# Altium project UmTRXv21.PRJPCB (part 2 of 2)

## Sheet LMS.SchDoc
size A3; Revision: 1; SheetNumber: 3
Used 2 times, as channels LMS-a, LMS-b. Parts and nets are listed once, with the designators drawn on the sheet.
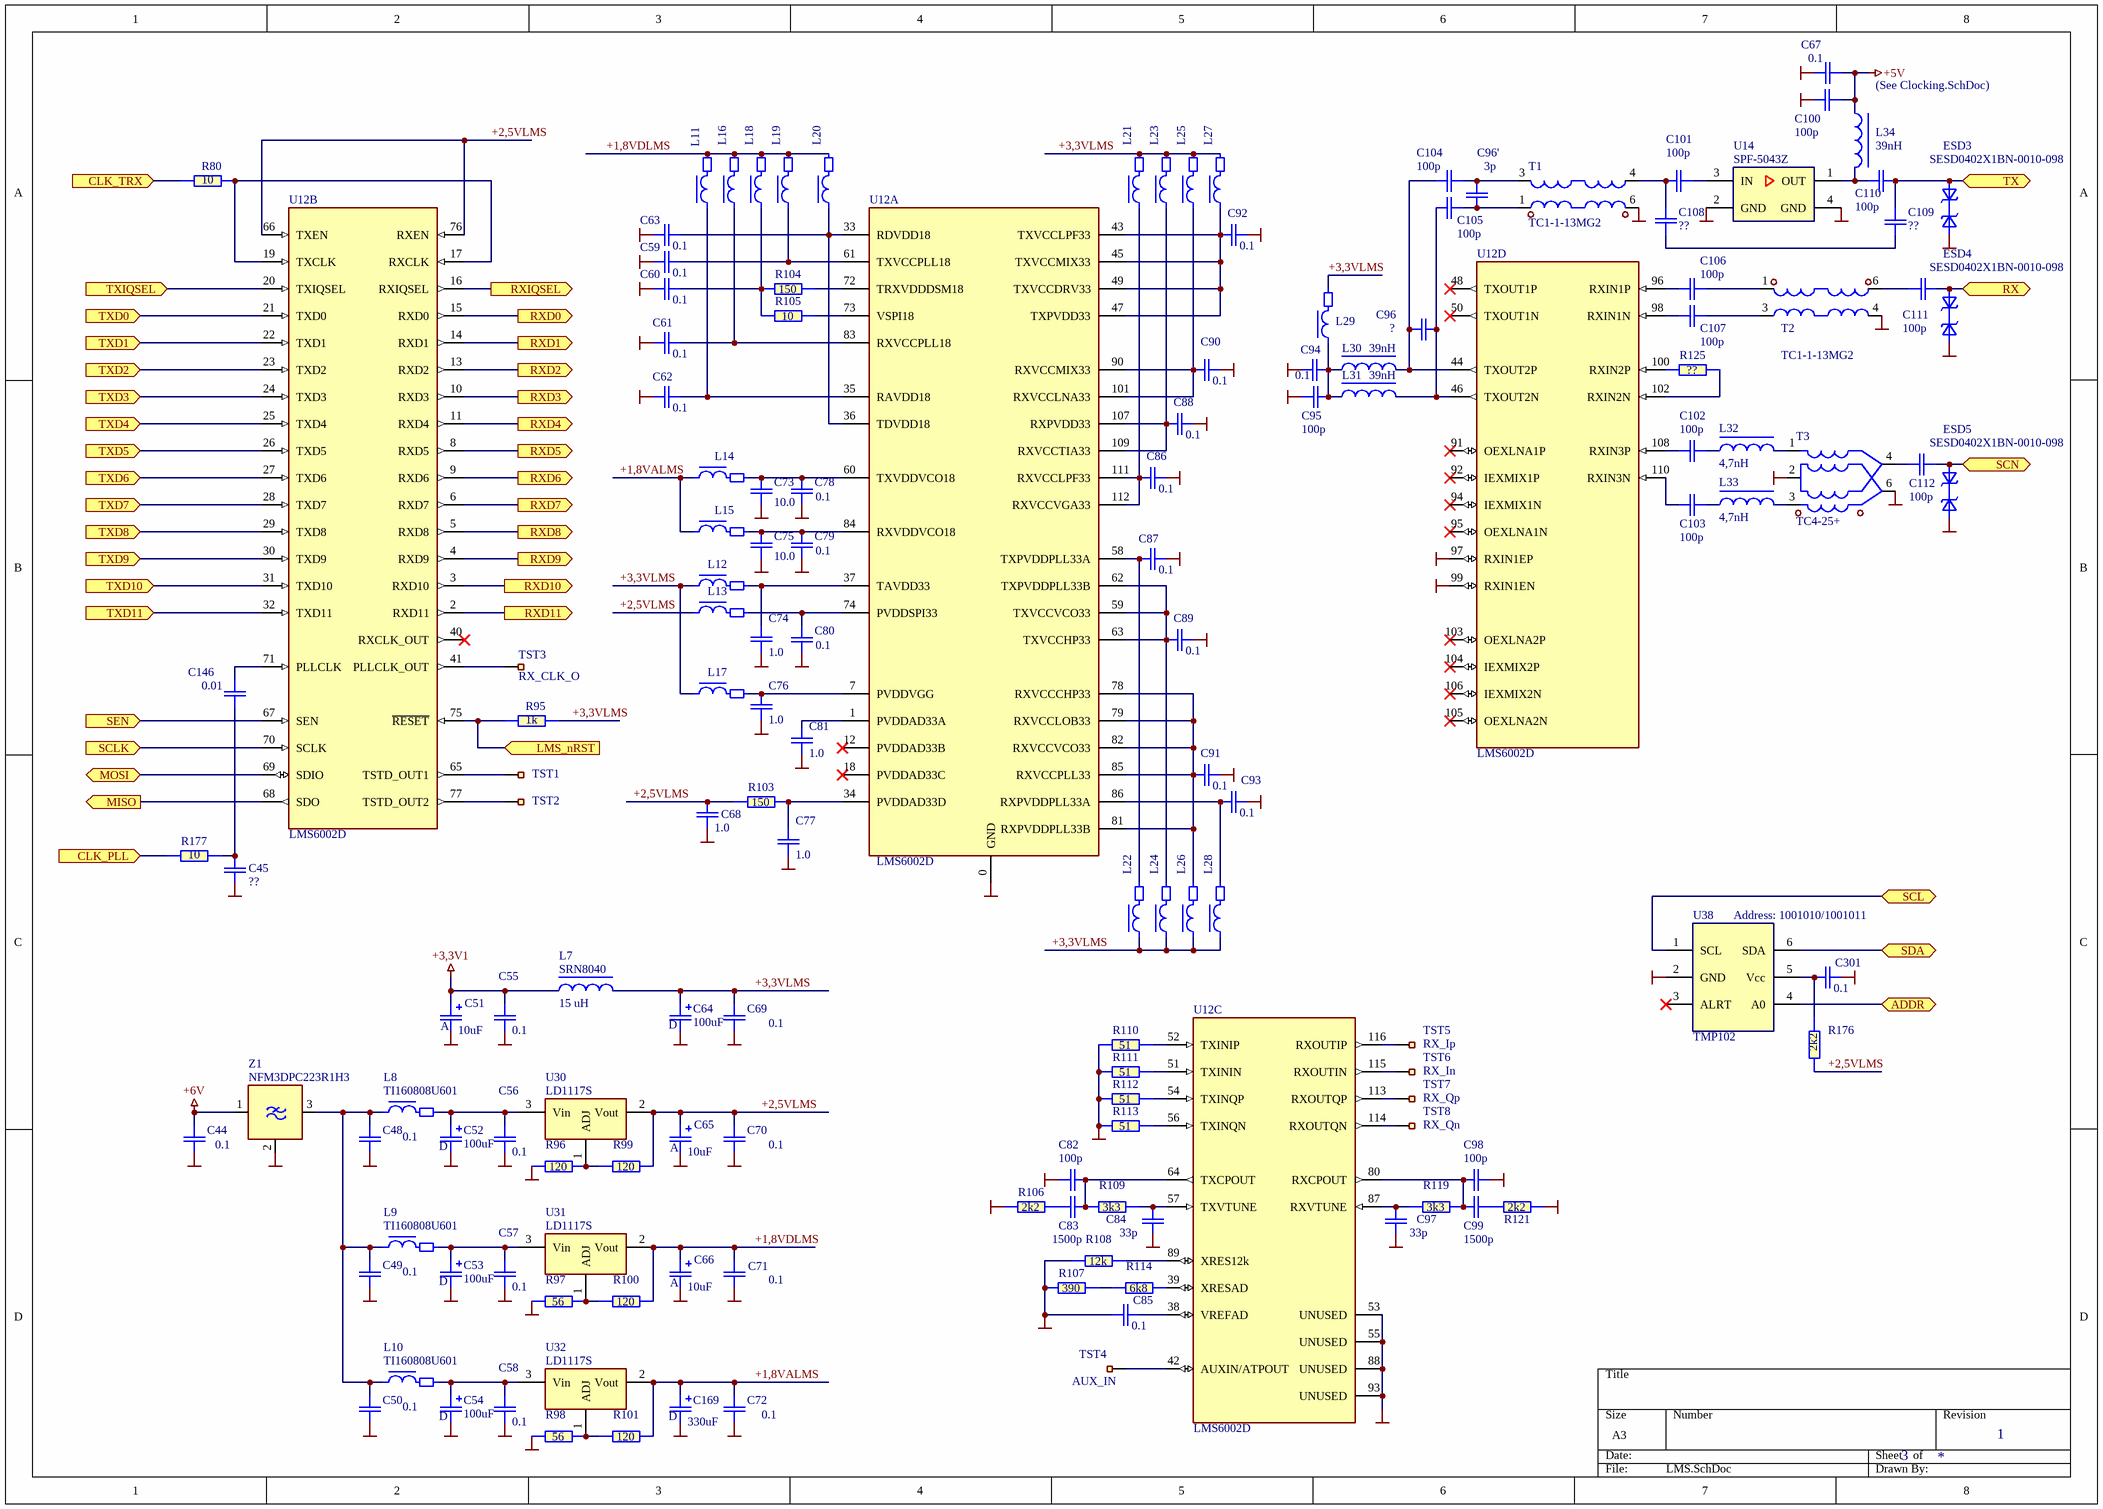
[diagram p4: LMS.SchDoc]

### Parts
C44  0.1  [C0402-Phillips]
C45  ??  [C0603-PHILLIPS]
C48  0.1  [C0402-Phillips]
C49  0.1  [C0402-Phillips]
C50  0.1  [C0402-Phillips]
C51  10uF  [CA3216]
C52  100uF  [cd7343]
C53  100uF  [cd7343]
C54  100uF  [cd7343]
C55  0.1  [C0402-Phillips]
C56  0.1  [C0402-Phillips]
C57  0.1  [C0402-Phillips]
C58  0.1  [C0402-Phillips]
C59  0.1  [C0402-Phillips]
C60  0.1  [C0402-Phillips]
C61  0.1  [C0402-Phillips]
C62  0.1  [C0402-Phillips]
C63  0.1  [C0402-Phillips]
C64  100uF  [cd7343]
C65  10uF  [CA3216]
C66  10uF  [CA3216]
C67  0.1  [C0402-Phillips]
C68  1.0  [C0603-PHILLIPS]
C69  0.1  [C0402-Phillips]
C70  0.1  [C0402-Phillips]
C71  0.1  [C0402-Phillips]
C72  0.1  [C0402-Phillips]
C73  10.0  [C0603-Phillips]
C74  1.0  [C0603-PHILLIPS]
C75  10.0  [C0603-Phillips]
C76  1.0  [C0603-PHILLIPS]
C77  1.0  [C0603-PHILLIPS]
C78  0.1  [C0402-Phillips]
C79  0.1  [C0402-cirq]
C80  0.1  [C0402-cirq]
C81  1.0  [C0603-PHILLIPS]
C82  100p  [C0603-PHILLIPS]
C83  1500p  [C0603-PHILLIPS]
C84  33p  [C0603-PHILLIPS]
C85  0.1  [C0402-Phillips]
C86  0.1  [C0402-Phillips]
C87  0.1  [C0402-Phillips]
C88  0.1  [C0402-cirq]
C89  0.1  [C0402-cirq]
C90  0.1  [C0402-Phillips]
C91  0.1  [C0402-Phillips]
C92  0.1  [C0402-cirq]
C93  0.1  [C0402-Phillips]
C94  0.1  [C0402-Phillips]
C95  100p  [C0603-PHILLIPS]
C96  ?  [C0603-PHILLIPS]
C96'  3p  [C0603-PHILLIPS]
C97  33p  [C0603-PHILLIPS]
C98  100p  [C0603-PHILLIPS]
C99  1500p  [C0603-PHILLIPS]
C100  100p  [C0603-PHILLIPS]
C101  100p  [C0603-PHILLIPS]
C102  100p  [C0603-PHILLIPS]
C103  100p  [C0603-PHILLIPS]
C104  100p  [C0603-PHILLIPS]
C105  100p  [C0603-PHILLIPS]
C106  100p  [C0603-PHILLIPS]
C107  100p  [C0603-PHILLIPS]
C108  ??  [C0603-PHILLIPS]
C109  ??  [C0603-PHILLIPS]
C110  100p  [C0603-PHILLIPS]
C111  100p  [C0603-PHILLIPS]
C112  100p  [C0603-PHILLIPS]
C146  0.01  [C0402-Phillips]
C169  330uF  [cd7343]
C301  0.1  [C0402-Phillips]
ESD3  SESD0402X1BN-0010-098  [R0402-Phillips]
ESD4  SESD0402X1BN-0010-098  [R0402-Phillips]
ESD5  SESD0402X1BN-0010-098  [R0402-Phillips]
L7  15 uH  [SRN8040]
L8  TI160808U601  [Ti160808-Phillips]
L9  TI160808U601  [Ti160808-Phillips]
L10  TI160808U601  [Ti160808-Phillips]
L11  TI160808U601  [Ti160808-Phillips]  (value not drawn)
L12  TI160808U601  [Ti160808-Phillips]  (value not drawn)
L13  TI160808U601  [Ti160808-Phillips]  (value not drawn)
L14  TI160808U601  [Ti160808-Phillips]  (value not drawn)
L15  TI160808U601  [Ti160808-Phillips]  (value not drawn)
L16  TI160808U601  [Ti160808-Phillips]  (value not drawn)
L17  TI160808U601  [Ti160808-Phillips]  (value not drawn)
L18  TI160808U601  [Ti160808-Phillips]  (value not drawn)
L19  TI160808U601  [Ti160808-Phillips]  (value not drawn)
L20  TI160808U601  [Ti160808-Phillips]  (value not drawn)
L21  TI160808U601  [Ti160808-Phillips]  (value not drawn)
L22  TI160808U601  [Ti160808-Phillips]  (value not drawn)
L23  TI160808U601  [Ti160808-Phillips]  (value not drawn)
L24  TI160808U601  [Ti160808-Phillips]  (value not drawn)
L25  TI160808U601  [Ti160808-Phillips]  (value not drawn)
L26  TI160808U601  [Ti160808-Phillips]  (value not drawn)
L27  TI160808U601  [Ti160808-Phillips]  (value not drawn)
L28  TI160808U601  [Ti160808-Phillips]  (value not drawn)
L29  TI160808U601  [Ti160808-Phillips]  (value not drawn)
L30  39nH  [TF160808-Phillips]
L31  39nH  [TF160808-Phillips]
L32  4,7nH  [TF160808-Phillips]
L33  4,7nH  [TF160808-Phillips]
L34  39nH  [TF160808-Phillips]
R80  10  [R0603-PHILLIPS]
R95  1k  [R0603-PHILLIPS]
R96  120  [R0603-PHILLIPS]
R97  56  [R0603-PHILLIPS]
R98  56  [R0603-PHILLIPS]
R99  120  [R0603-PHILLIPS]
R100  120  [R0603-PHILLIPS]
R101  120  [R0603-PHILLIPS]
R103  150  [R0603-PHILLIPS]
R104  150  [R0603-PHILLIPS]
R105  10  [R0603-PHILLIPS]
R106  2k2  [R0603-PHILLIPS]
R107  390  [R0603-PHILLIPS]
R108  12k  [R0603-PHILLIPS]
R109  3k3  [R0603-PHILLIPS]
R110  51  [R0603-PHILLIPS]
R111  51  [R0603-PHILLIPS]
R112  51  [R0603-PHILLIPS]
R113  51  [R0603-PHILLIPS]
R114  6k8  [R0603-PHILLIPS]
R119  3k3  [R0603-PHILLIPS]
R121  2k2  [R0603-PHILLIPS]
R125  ??  [R0603-PHILLIPS]
R176  2k2  [R0603-PHILLIPS]
R177  10  [R0603-PHILLIPS]
T1  TC1-1-13MG2  [AT224-1]
T2  TC1-1-13MG2  [AT224-1]
T3  TC4-25+  [AT224-1]
TST1  (no value)  [kp40x40]
TST2  (no value)  [kp40x40]
TST3  RX_CLK_O  [kp40x40]
TST4  AUX_IN  [kp40x40]
TST5  RX_Ip  [kp40x40]
TST6  RX_In  [kp40x40]
TST7  RX_Qp  [kp40x40]
TST8  RX_Qn  [kp40x40]
U12  LMS6002D  [DQFN120(9x9/0.5mm)]  (parts A,B,C,D of 4)
U14  SPF-5043Z  [SOT-343[2X1.25]]
U30  LD1117S  [SOT-223-1]
U31  LD1117S  [SOT-223-1]
U32  LD1117S  [SOT-223-1]
U38  TMP102  Address: 1001010/1001011  [PDSO-G6]
Z1  NFM3DPC223R1H3  [NFM3DP]

### Ports
ADDR, CLK_PLL (in), CLK_TRX (in), LMS_nRST (in), MISO (out), MOSI (bidir), RX, RXD0 (out), RXD1 (out), RXD2 (out), RXD3 (out), RXD4 (out), RXD5 (out), RXD6 (out), RXD7 (out), RXD8 (out), RXD9 (out), RXD10 (out), RXD11 (out), RXIQSEL (out), SCL, SCLK (in), SCN, SDA, SEN (in), TX, TXD0 (in), TXD1 (in), TXD2 (in), TXD3 (in), TXD4 (in), TXD5 (in), TXD6 (in), TXD7 (in), TXD8 (in), TXD9 (in), TXD10 (in), TXD11 (in), TXIQSEL (in)

### Nets
+3,3V1: C51.1(+) C55.1 L7.1
+5V: C67.2 C100.2 L34.1
+6V: C44.1 Z1.1
GND: C44.2 C45.1 C48.2 C49.2 C50.2 C51.2(-) C52.2(-) C53.2(-) C54.2(-) C55.2 C56.2 C57.2 C58.2 C59.1 C60.1 C61.1 C62.1 C63.1 C64.2(-) C65.2(-) C66.2(-) C67.1 C68.2 C69.2 C70.2 C71.2 C72.2 C73.2 C74.2 C75.2 C76.2 C77.2 C78.2 C79.2 C80.2 C81.2 C82.2 C84.1 C85.1 C86.2 C87.2 C88.2 C89.2 C90.2 C91.2 C92.2 C93.2 C94.1 C95.2 C97.1 C98.2 C100.1 C169.2(-) C301.2 ESD3.1(A1) ESD4.1(A1) ESD5.1(A1) R96.1 R97.1 R98.1 R106.1 R107.1 R108.1 R110.1 R111.1 R112.1 R113.1 R121.2 T1.6(Pri_Dot) T2.4(Pri) T3.2(Sec_CT) T3.6(Pri_Dot) U12.0(GND) U12.53(UNUSED) U12.55(UNUSED) U12.88(UNUSED) U12.93(UNUSED) U12.97(RXIN1EP) U12.99(RXIN1EN) U14.2(GND) U14.4(GND) U38.2(GND) Z1.2
+1,8VALMS: C72.1 C169.1(+) L14.1 L15.1 R101.2 U32.2(Vout)
+1,8VDLMS: C66.1(+) C71.1 L11.2 L16.2 L18.2 L19.2 L20.2 R100.2 U31.2(Vout)
+2,5VLMS: C65.1(+) C68.1 C70.1 L13.1 R99.2 R103.1 R176.1 U12.66(TXEN) U12.76(RXEN) U30.2(Vout)
+3,3VLMS: C64.1(+) C69.1 L7.2 L12.1 L17.1 L21.2 L22.1 L23.2 L24.1 L25.2 L26.1 L27.2 L28.1 L29.2 R95.2
ADDR: U38.4(A0) ; port ADDR
CLK_PLL: R177.1 ; port CLK_PLL
CLK_TRX: R80.1 ; port CLK_TRX
LMS_nRST: R95.1 U12.75(~{RESET}) ; port LMS_nRST
MISO: U12.68(SDO) ; port MISO
MOSI: U12.69(SDIO) ; port MOSI
RX: C111.1 ESD4.2(A2) ; port RX
RXD0: U12.15(RXD0) ; port RXD0
RXD1: U12.14(RXD1) ; port RXD1
RXD2: U12.13(RXD2) ; port RXD2
RXD3: U12.10(RXD3) ; port RXD3
RXD4: U12.11(RXD4) ; port RXD4
RXD5: U12.8(RXD5) ; port RXD5
RXD6: U12.9(RXD6) ; port RXD6
RXD7: U12.6(RXD7) ; port RXD7
RXD8: U12.5(RXD8) ; port RXD8
RXD9: U12.4(RXD9) ; port RXD9
RXD10: U12.3(RXD10) ; port RXD10
RXD11: U12.2(RXD11) ; port RXD11
RXIQSEL: U12.16(RXIQSEL) ; port RXIQSEL
SCL: U38.1(SCL) ; port SCL
SCLK: U12.70(SCLK) ; port SCLK
SCN: C112.2 ESD5.2(A2) ; port SCN
SDA: U38.6(SDA) ; port SDA
SEN: U12.67(SEN) ; port SEN
TX: C109.2 C110.2 ESD3.2(A2) ; port TX
TXD0: U12.21(TXD0) ; port TXD0
TXD1: U12.22(TXD1) ; port TXD1
TXD2: U12.23(TXD2) ; port TXD2
TXD3: U12.24(TXD3) ; port TXD3
TXD4: U12.25(TXD4) ; port TXD4
TXD5: U12.26(TXD5) ; port TXD5
TXD6: U12.27(TXD6) ; port TXD6
TXD7: U12.28(TXD7) ; port TXD7
TXD8: U12.29(TXD8) ; port TXD8
TXD9: U12.30(TXD9) ; port TXD9
TXD10: U12.31(TXD10) ; port TXD10
TXD11: U12.32(TXD11) ; port TXD11
TXIQSEL: U12.20(TXIQSEL) ; port TXIQSEL
NetC45_2: C45.2 C146.1 R177.2
NetC48_1: C48.1 C49.1 C50.1 L8.1 L9.1 L10.1 Z1.3
NetC52_1: C52.1(+) C56.1 L8.2 U30.3(Vin)
NetC53_1: C53.1(+) C57.1 L9.2 U31.3(Vin)
NetC54_1: C54.1(+) C58.1 L10.2 U32.3(Vin)
NetC59_2: C59.2 L19.1 U12.61(TXVCCPLL18)
NetC60_2: C60.2 L18.1 R104.1 R105.1
NetC61_2: C61.2 L16.1 U12.83(RXVCCPLL18)
NetC62_2: C62.2 L11.1 U12.35(RAVDD18)
NetC63_2: C63.2 L20.1 U12.33(RDVDD18) U12.36(TDVDD18)
NetC73_1: C73.1 C78.1 L14.2 U12.60(TXVDDVCO18)
NetC74_1: C74.1 L12.2 U12.37(TAVDD33)
NetC75_1: C75.1 C79.1 L15.2 U12.84(RXVDDVCO18)
NetC76_1: C76.1 L17.2 U12.7(PVDDVGG)
NetC77_1: C77.1 R103.2 U12.34(PVDDAD33D)
NetC80_1: C80.1 L13.2 U12.74(PVDDSPI33)
NetC81_1: C81.1 U12.1(PVDDAD33A)
NetC82_1: C82.1 C83.1 R109.1 U12.64(TXCPOUT)
NetC83_2: C83.2 R106.2
NetC84_2: C84.2 R109.2 U12.57(TXVTUNE)
NetC85_2: C85.2 U12.38(VREFAD)
NetC86_1: C86.1 L21.1 U12.111(RXVCCLPF33) U12.112(RXVCCVGA33)
NetC87_1: C87.1 L22.2 U12.58(TXPVDDPLL33A)
NetC88_1: C88.1 L23.1 U12.107(RXPVDD33) U12.109(RXVCCTIA33)
NetC89_1: C89.1 L24.2 U12.59(TXVCCVCO33) U12.62(TXPVDDPLL33B) U12.63(TXVCCHP33)
NetC90_1: C90.1 L25.1 U12.90(RXVCCMIX33) U12.101(RXVCCLNA33)
NetC91_1: C91.1 L26.2 U12.78(RXVCCCHP33) U12.79(RXVCCLOB33) U12.81(RXPVDDPLL33B) U12.82(RXVCCVCO33) U12.85(RXVCCPLL33)
NetC92_1: C92.1 L27.1 U12.43(TXVCCLPF33) U12.45(TXVCCMIX33) U12.47(TXPVDD33) U12.49(TXVCCDRV33)
NetC93_1: C93.1 L28.2 U12.86(RXPVDDPLL33A)
NetC94_2: C94.2 C95.1 L29.1 L30.1 L31.1
NetC96'_1: C96'.1 C105.2 T1.1(Sec)
NetC96'_2: C96'.2 C104.2 T1.3(Sec_Dot)
NetC96_1: C96.1 C105.1 L31.2 U12.46(TXOUT2N)
NetC96_2: C96.2 C104.1 L30.2 U12.44(TXOUT2P)
NetC97_2: C97.2 R119.1 U12.87(RXVTUNE)
NetC98_1: C98.1 C99.1 R119.2 U12.80(RXCPOUT)
NetC99_2: C99.2 R121.1
NetC101_1: C101.1 C108.1 T1.4(Pri)
NetC101_2: C101.2 U14.3(IN)
NetC102_1: C102.1 U12.108(RXIN3P)
NetC102_2: C102.2 L32.1
NetC103_1: C103.1 U12.110(RXIN3N)
NetC103_2: C103.2 L33.1
NetC106_1: C106.1 U12.96(RXIN1P)
NetC106_2: C106.2 T2.1(Sec)
NetC107_1: C107.1 U12.98(RXIN1N)
NetC107_2: C107.2 T2.3(Sec_Dot)
NetC108_2: C108.2 C109.1
NetC110_1: C110.1 L34.2 U14.1(OUT)
NetC111_2: C111.2 T2.6(Pri_Dot)
NetC112_1: C112.1 T3.4(Pri)
NetC146_2: C146.2 U12.71(PLLCLK)
NetC301_1: C301.1 R176.2 U38.5(Vcc)
NetL32_2: L32.2 T3.1(Sec)
NetL33_2: L33.2 T3.3(Sec_Dot)
NetR80_2: R80.2 U12.17(RXCLK) U12.19(TXCLK)
NetR96_2: R96.2 R99.1 U30.1(ADJ)
NetR97_2: R97.2 R100.1 U31.1(ADJ)
NetR98_2: R98.2 R101.1 U32.1(ADJ)
NetR104_2: R104.2 U12.72(TRXVDDDSM18)
NetR105_2: R105.2 U12.73(VSPI18)
NetR107_2: R107.2 R114.1
NetR108_2: R108.2 U12.89(XRES12k)
NetR110_2: R110.2 U12.52(TXINIP)
NetR111_2: R111.2 U12.51(TXININ)
NetR112_2: R112.2 U12.54(TXINQP)
NetR113_2: R113.2 U12.56(TXINQN)
NetR114_2: R114.2 U12.39(XRESAD)
NetR125_1: R125.1 U12.100(RXIN2P)
NetR125_2: R125.2 U12.102(RXIN2N)
NetTST1_1: TST1.1 U12.65(TSTD_OUT1)
NetTST2_1: TST2.1 U12.77(TSTD_OUT2)
NetTST3_1: TST3.1 U12.41(PLLCLK_OUT)
NetTST4_1: TST4.1 U12.42(AUXIN/ATPOUT)
NetTST5_1: TST5.1 U12.116(RXOUTIP)
NetTST6_1: TST6.1 U12.115(RXOUTIN)
NetTST7_1: TST7.1 U12.113(RXOUTQP)
NetTST8_1: TST8.1 U12.114(RXOUTQN)

Not connected (* = marked no-connect by the designer): U12 12(PVDDAD33B)* 18(PVDDAD33C)* 40(RXCLK_OUT)* 48(TXOUT1P)* 50(TXOUT1N)* 91(OEXLNA1P)* 92(IEXMIX1P)* 94(IEXMIX1N)* 95(OEXLNA1N)* 103(OEXLNA2P)* 104(IEXMIX2P)* 105(OEXLNA2N)* 106(IEXMIX2N)*; U38 3(ALRT)*

### Channels
LMS-a: designators end in -1; ports ADDR=SDA CLK_PLL=CLK_PLL1 CLK_TRX=CLK_TRX1 LMS_nRST=LMS1_nRST MISO=MISO1 MOSI=MOSI1 RX=RX RXD0=RX1D0 RXD1=RX1D1 RXD2=RX1D2 RXD3=RX1D3 RXD4=RX1D4 RXD5=RX1D5 RXD6=RX1D6 RXD7=RX1D7 RXD8=RX1D8 RXD9=RX1D9 RXD10=RX1D10 RXD11=RX1D11 RXIQSEL=RX1IQSEL SCL=SCL SCLK=SCLK1 SCN=SCN SDA=SDA SEN=SEN1 TX=TX TXD0=TX1D0 TXD1=TX1D1 TXD2=TX1D2 TXD3=TX1D3 TXD4=TX1D4 TXD5=TX1D5 TXD6=TX1D6 TXD7=TX1D7 TXD8=TX1D8 TXD9=TX1D9 TXD10=TX1D10 TXD11=TX1D11 TXIQSEL=TX1IQSEL
LMS-b: designators end in -2; ports ADDR=SCL CLK_PLL=CLK_PLL2 CLK_TRX=CLK_TRX2 LMS_nRST=LMS2_nRST MISO=MISO2 MOSI=MOSI2 RX=RX RXD0=RX2D0 RXD1=RX2D1 RXD2=RX2D2 RXD3=RX2D3 RXD4=RX2D4 RXD5=RX2D5 RXD6=RX2D6 RXD7=RX2D7 RXD8=RX2D8 RXD9=RX2D9 RXD10=RX2D10 RXD11=RX2D11 RXIQSEL=RX2IQSEL SCL=SCL SCLK=SCLK2 SCN=SCN SDA=SDA SEN=SEN2 TX=TX TXD0=TX2D0 TXD1=TX2D1 TXD2=TX2D2 TXD3=TX2D3 TXD4=TX2D4 TXD5=TX2D5 TXD6=TX2D6 TXD7=TX2D7 TXD8=TX2D8 TXD9=TX2D9 TXD10=TX2D10 TXD11=TX2D11 TXIQSEL=TX2IQSEL

### Notes on the sheet
- (See Clocking.SchDoc)
- (in symbol CA3216) A
- (in symbol CD7343) D

### Library data of the parts
C44 C48-C50 C55-C63 C67 C69-C72 C78-C80 C85-C94 C146 C301 = C0402: Конденсатор; Manufacturer: MURATA; Tolerance: 20%; Name: SMD0402; U/P/TKE: Y5V
  C44 C48-C50 C55-C63 C67 C69-C72 C78-C80 C85-C94 C301: Value: 0.1
  C146: Value: 0.01
C45 C82-C84 C95 C96 C96' C97-C112 = C0603: Конденсатор; Manufacturer: MURATA; Tolerance: 20%; Name: SMD0603; U/P/TKE: NP0
  C45 C108 C109: Value: ??
  C82 C95 C98 C100-C107 C110-C112: Value: 100p
  C83 C99: Value: 1500p
  C84 C97: Value: 33p
  C96: Value: ?
  C96': Value: 3p
C51 C65 C66 = CA3216: Конденсатор; Manufacturer: SPRAGUE; Name: Case A; U/P/TKE: 16V; Value: 10uF
C52-C54 C64 = CD7343: Конденсатор; Manufacturer: SPRAGUE; Name: CASE-G; U/P/TKE: 16V; Value: 100uF
C68 C73-C77 C81 = C0603: Конденсатор; Manufacturer: MURATA; Tolerance: 20%; Name: SMD0603; U/P/TKE: Y5V
  C68 C74 C76 C77 C81: Value: 1.0
  C73 C75: Value: 10.0
C169 = CD7343: Конденсатор; Manufacturer: Kemet; Name: CASE-D; U/P/TKE: 10V; Value: 330uF
ESD3-ESD5 = SESD0402X: ESD diod bi-directional; Manufacturer: Tyco Electronics Corp; U/P/TKE: 9.8V; Name: SESD0402X1BN-0010-098
L7 = L-SRN8040: Индуктивность; Manufacturer: BOURNS; Name: SRN8040; Value: 15 uH
L8-L29 = TI160808: Дроссель ЭМС; Manufacturer: MURATA; Name: TI160808U601; Value: *
L30-L34 = TF160808: Индуктивность; Manufacturer: SMD; Name: TF160808
  L30 L31 L34: Value: 39nH
  L32 L33: Value: 4,7nH
R80 R95-R101 R103-R114 R119 R121 R125 R176 R177 = R0603: Резистор; Manufacturer: YAGEO; Tolerance: 5%; Name: SMD0603; U/P/TKE: 0.1W
  R80 R105 R177: Value: 10
  R95: Value: 1k
  R96 R99-R101: Value: 120
  R97 R98: Value: 56
  R103 R104: Value: 150
  R106 R121 R176: Value: 2k2
  R107: Value: 390
  R108: Value: 12k
  R109 R119: Value: 3k3
  R110-R113: Value: 51
  R114: Value: 6k8
  R125: Value: ??
T1 T2 = TC1-1-13: Трансформатор; Manufacturer: Mini-Cirquits; PDF: d:\Proj\Components\Mini-Circuits\TC1-1-13MG2+.pdf; Misc: RF Transformer; Name: TC1-1-13MG2
T3 = TC4-25: Трансформатор; Manufacturer: Mini-Cirquits; PDF: d:\Proj\Components\Mini-Circuits\TC4-25+.pdf; Misc: RF Transformer; Name: TC4-25+
TST1-TST8 = KP: Контактная площадка; Manufacturer: Конструктив
  TST3: Name: RX_CLK_O
  TST4: Name: AUX_IN
  TST5: Name: RX_Ip
  TST6: Name: RX_In
  TST7: Name: RX_Qp
  TST8: Name: RX_Qn
U12 = LMS6002D: Микросхема; Manufacturer: Lime Microsystems; Misc: Multi-band Multi-standard  Transceiver with Digital Interface; Name: LMS6002D
U14 = SPF-5043Z: Микросхема; Manufacturer: RFMD; Swap: No; PDF: D:\Proj\Components\Sirenza\SPF-5043Z_Datasheet.pdf; Name: SPF-5043Z
U30-U32 = LD1117ADJ: Микросхема; Manufacturer: STMicro; Swap: No; Name: LD1117S
U38 = TMP102: IC temperature sensor I2C; Manufacturer: TI; Name: TMP102
Z1 = NFM3DP: Фильтр; Manufacturer: Murata; Misc: Фильтр электромагнитных помех; Value: 0.022uF; PDF: D:\DataSheets\MuRata\EMI_FILTERS.pdf; Name: NFM3DPC223R1H3

## Nets that join several sheets
+2,5VETH: PwrAndBias (21 pins), GBEthernet (12 pins)
+3,3V1: PwrAndBias (12 pins), LMS-a (C51-1.1 C55-1.1 L7-1.1), LMS-b (C51-2.1 C55-2.1 L7-2.1)
+3,3VFPGA: PwrAndBias (61 pins), GBEthernet (C42.1 L5.2), EEpromConfig (37 pins)
+5V: LMS-a (C67-1.2 C100-1.2 L34-1.1), LMS-b (C67-2.2 C100-2.2 L34-2.1)
+6V: Total (X12.16), PwrAndBias (C125.1 L44.2), LMS-a (C44-1.1 Z1-1.1), LMS-b (C44-2.1 Z1-2.1)
GND: Total (16 pins), PwrAndBias (246 pins), GBEthernet (19 pins), EEpromConfig (43 pins), LMS-a (83 pins), LMS-b (83 pins)
AUX_LD1: Total (X12.11), EEpromConfig (U8.AB6)
AUX_LD2: Total (X12.12), EEpromConfig (U8.AB9)
AUX_SCLK: Total (X12.6), EEpromConfig (U8.AB12)
AUX_SDAT: Total (X12.5), EEpromConfig (U8.AB8)
AUX_SEN1: Total (X12.7), EEpromConfig (U8.AA8)
AUX_SEN2: Total (X12.8), EEpromConfig (U8.AB11)
AUX_SEN3: Total (X12.9), EEpromConfig (U8.AB7)
AUX_SEN4: Total (X12.10), EEpromConfig (U8.AB10)
AUX_XX: Total (X12.13), EEpromConfig (U8.AA6)
ETH_LEDG: GBEthernet (R44.2), EEpromConfig (U8.Y15)
ETH_LEDO: GBEthernet (R42.2), EEpromConfig (U8.W12)
FAN_ON: PwrAndBias (U35.4), EEpromConfig (U8.AB14)
OVERHEAT: PwrAndBias (R173.2 U35.6), EEpromConfig (U8.AB13)
RX: Total (X9.1 X9'.1), LMS-a (C111-1.1 ESD4-1.2)
RX: Total (X10.1 X10'.1), LMS-b (C111-2.1 ESD4-2.2)
SCL: EEpromConfig (R26.2 U7.6 U8.AA14), LMS-a (U38-1.1), LMS-b (U38-2.1 U38-2.4)
SCN: Total (X14.1 X14'.1), LMS-a (C112-1.2 ESD5-1.2)
SCN: Total (X15.1 X15'.1), LMS-b (C112-2.2 ESD5-2.2)
SDA: EEpromConfig (R27.2 U7.5 U8.AA16), LMS-a (U38-1.4 U38-1.6), LMS-b (U38-2.6)
TX: Total (X8.1 X8'.1), LMS-a (C109-1.2 C110-1.2 ESD3-1.2)
TX: Total (X11.1 X11'.1), LMS-b (C109-2.2 C110-2.2 ESD3-2.2)

## Assembly variants
UmTRXv2.1_2U_20dBm_TCXO: not fitted C45-1 C45-2 C96-1 C96-2 C108-1 C108-2 C109-1 C109-2 LED1A' LED1B' LED1C' LED2A' LED2B' LED2C' LED3A' LED3B' LED3C' R2 R6 R10 R12 R52 R53 R54 R62 R79 R81 R82 R83 R84 R85 R86 R87 R88 R125-1 R125-2 R158 R171 R171' U2 U6 X2-1 X2-2 X5' X8' X9' X10' X11' X14' X15' X16
UmTRXv2.1_20dBm_TCXO: not fitted C45-1 C45-2 C96-1 C96-2 C108-1 C108-2 C109-1 C109-2 LED1 LED2 LED3 R2 R6 R10 R12 R52 R53 R54 R62 R79 R81 R82 R83 R84 R85 R86 R87 R88 R125-1 R125-2 R158 R171 R171' U2 U6 X2-1 X2-2 X5 X8' X9' X10' X11' X14' X15' X16
UmTRXv2.1_empty: not fitted C4 C5 C6 C7 C8 C9 C10 C11 C12 C13 C14 C15 C17 C18 C19 C20 C21 C22 C23 C24 C25 C26 C27 C32 C33 C34 C35 C36 C37 C38 C39 C40 C41 C42 C43 C44-1 C44-2 C45-1 C45-2 C48-1 C48-2 C49-1 C49-2 C50-1 C50-2 C51-1 C51-2 C52-1 C52-2 C53-1 C53-2 C54-1 C54-2 C55-1 C55-2 C56-1 C56-2 C57-1 C57-2 C58-1 C58-2 C59-1 C59-2 C60-1 C60-2 C61-1 C61-2 C62-1 C62-2 C63-1 C63-2 C64-1 C64-2 C65-1 C65-2 C66-1 C66-2 C67-1 C67-2 C68-1 C68-2 C69-1 C69-2 C70-1 C70-2 C71-1 C71-2 C72-1 C72-2 C73-1 C73-2 C74-1 C74-2 C75-1 C75-2 C76-1 C76-2 C77-1 C77-2 C78-1 C78-2 C79-1 C79-2 C80-1 C80-2 C81-1 C81-2 C82-1 C82-2 C83-1 C83-2 C84-1 C84-2 C85-1 C85-2 C86-1 C86-2 C87-1 C87-2 C88-1 C88-2 C89-1 C89-2 C90-1 C90-2 C91-1 C91-2 C92-1 C92-2 C93-1 C93-2 C94-1 C94-2 C95-1 C95-2 C96'-1 C96'-2 C96-1 C96-2 C97-1 C97-2 C98-1 C98-2 C99-1 C99-2 C100-1 C100-2 C101-1 C101-2 C102-1 C102-2 C103-1 C103-2 C104-1 C104-2 C105-1 C105-2 C106-1 C106-2 C107-1 C107-2 C108-1 C108-2 C109-1 C109-2 C110-1 C110-2 C111-1 C111-2 C112-1 C112-2 C113 C114 C115 C116 C117 C118 C119 C120 C125 C127 C128 C129 C131 C132 C133 C135 C136 C137 C138 C139 C140 C141 C143 C144 C145 C146 C146-1 C146-2 C147 C148 C150 C151 C152 C153 C154 C156 C157 C158 C159 C161 C162 C163 C164 C165 C166 C168 C169-1 C169-2 C171 C172 C174 C175 C176 C177 C178 C179 C180 C181 C182 C183 C184 C185 C186 C187 C188 C189 C190 C191 C192 C193 C194 C196 C197 C198 C199 C200 C201 C202 C203 C204 C205 C206 C207 C208 C209 C210 C211 C212 C213 C214 C215 C216 C217 C218 C219 C220 C221 C222 C223 C224 C225 C227 C228 C229 C230 C231 C232 C233 C234 C235 C236 C237 C238 C239 C240 C241 C242 C243 C244 C245 C246 C247 C248 C249 C250 C251 C252 C254 C255 C256 C257 C258 C259 C260 C261 C262 C263 C264 C265 C266 C267 C268 C269 C270 C271 C272 C273 C274 C275 C276 C277 C278 C279 C280 C281 C282 C283 C284 C285 C286 C287 C289 C290 C291 C292 C293 C294 C295 C296 C297 C298 C299 C300 C301-1 C301-2 D1 D2 D3 D4 ESD1 ESD2 ESD3 ESD3-1 ESD3-2 ESD4-1 ESD4-2 ESD5-1 ESD5-2 F1 L1 L2 L3 L4 L5 L7-1 L7-2 L8-1 L8-2 L9-1 L9-2 L10-1 L10-2 L11-1 L11-2 L12-1 L12-2 L13-1 L13-2 L14-1 L14-2 L15-1 L15-2 L16-1 L16-2 L17-1 L17-2 L18-1 L18-2 L19-1 L19-2 L20-1 L20-2 L21-1 L21-2 L22-1 L22-2 L23-1 L23-2 L24-1 L24-2 L25-1 L25-2 L26-1 L26-2 L27-1 L27-2 L28-1 L28-2 L29-1 L29-2 L30-1 L30-2 L31-1 L31-2 L32-1 L32-2 L33-1 L33-2 L34-1 L34-2 L35 L36 L37 L40 L41 L42 L43 L44 L45 L46 LED1 LED1A' LED1B' LED1C' LED2 LED2A' LED2B' LED2C' LED3 LED3A' LED3B' LED3C' LED4 LED5 LED6 Q1 Q2 Q3 Q4 R1 R2 R3 R4 R5 R6 R7 R8 R9 R10 R11 R12 R13 R14 R15 R16 R17 R18 R19 R20 R21 R22 R23 R24 R26 R27 R28 R29 R30 R31 R32 R33 R34 R35 R36 R37 R38 R41 R42 R43 R44 R45 R46 R47 R48 R49 R50 R51 R52 R53 R54 R55 R56 R57 R58 R59 R60 R61 R62 R63 R64 R65 R66 R67 R78 R79 R80-1 R80-2 R81 R82 R83 R84 R85 R86 R87 R88 R89 R90 R91 R92 R93 R94 R95-1 R95-2 R96-1 R96-2 R97-1 R97-2 R98-1 R98-2 R99-1 R99-2 R100-1 R100-2 R101-1 R101-2 R103-1 R103-2 R104-1 R104-2 R105-1 R105-2 R106-1 R106-2 R107-1 R107-2 R108-1 R108-2 R109-1 R109-2 R110-1 R110-2 R111-1 R111-2 R112-1 R112-2 R113-1 R113-2 R114-1 R114-2 R119-1 R119-2 R121-1 R121-2 R122 R123 R124 R125-1 R125-2 R128 R129 R131 R132 R133 R134 R135 R136 R137 R138 R149 R152 R153 R154 R155 R156 R157 R158 R159 R162 R163 R164 R165 R166 R168 R169 R170 R171 R171' R172 R172' R173 R174 R176-1 R176-2 R177-1 R177-2 RA1 RA2 RA3 S1 S2 S3 T1-1 T1-2 T2-1 T2-2 T3-1 T3-2 TST1-1 TST1-2 TST2-1 TST2-2 TST3-1 TST3-2 TST4-1 TST4-2 TST5-1 TST5-2 TST6-1 TST6-2 TST7-1 TST7-2 TST8-1 TST8-2 TST9 TST10 TST11 TST12 TST13 TST14 TST15 TST16 U1 U2 U3 U4 U5 U6 U6A U7 U8 U9 U10 U11 U12-1 U12-2 U14-1 U14-2 U15 U16 U17 U18 U26 U27 U28 U30-1 U30-2 U31-1 U31-2 U32-1 U32-2 U33 U34 U35 U36 U37 U38-1 U38-2 X1 X2-1 X2-2 X3 X4 X5 X5' X6 X7 X8 X8' X9 X9' X10 X10' X11 X11' X12 X13 X14 X14' X15 X15' X16 X17 X18 Z1-1 Z1-2
UmTRXv2.1_full_assembly: all parts fitted